# Altium schematic sheet Digital Output (DOUT).SchDoc
size A4; SheetNumber: 6; SheetTotal: 10
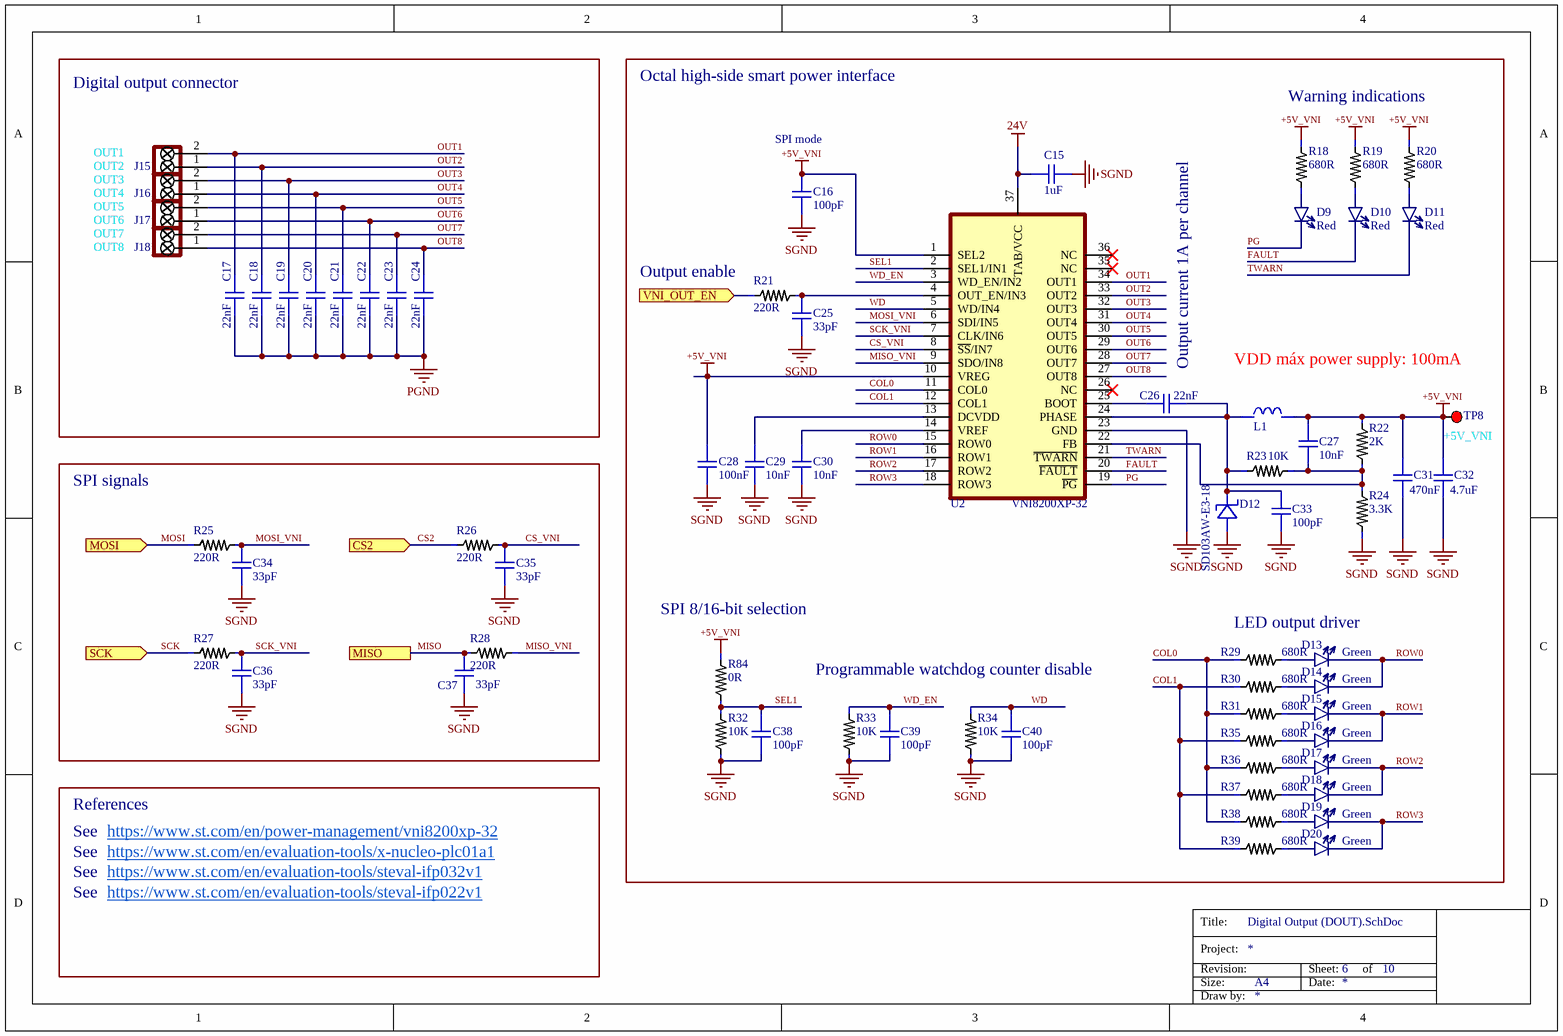
[diagram p0: Digital Output (DOUT).SchDoc]

## Parts
C15  value 1uF  [CAPC1005N]  (hidden comment: Multilayer Ceramic Capacitors)
C16  value 100pF  [CAPC1005N]  (hidden comment: Multilayer Ceramic Capacitors)
C17  value 22nF  [CAPC2012N]  (hidden comment: Multilayer Ceramic Capacitors)
C18  value 22nF  [CAPC2012N]  (hidden comment: Multilayer Ceramic Capacitors)
C19  value 22nF  [CAPC2012N]  (hidden comment: Multilayer Ceramic Capacitors)
C20  value 22nF  [CAPC2012N]  (hidden comment: Multilayer Ceramic Capacitors)
C21  value 22nF  [CAPC2012N]  (hidden comment: Multilayer Ceramic Capacitors)
C22  value 22nF  [CAPC2012N]  (hidden comment: Multilayer Ceramic Capacitors)
C23  value 22nF  [CAPC2012N]  (hidden comment: Multilayer Ceramic Capacitors)
C24  value 22nF  [CAPC2012N]  (hidden comment: Multilayer Ceramic Capacitors)
C25  value 33pF  [CAPC1005N]  (hidden comment: Multilayer Ceramic Capacitors)
C26  value 22nF  [CAPC1005N]  (hidden comment: Multilayer Ceramic Capacitors)
C27  value 10nF  [CAPC1005N]  (hidden comment: Multilayer Ceramic Capacitors)
C28  value 100nF  [CAPC1005N]  (hidden comment: Multilayer Ceramic Capacitors)
C29  value 10nF  [CAPC1005N]  (hidden comment: Multilayer Ceramic Capacitors)
C30  value 10nF  [CAPC1005N]  (hidden comment: Multilayer Ceramic Capacitors)
C31  value 470nF  [CAPC1005N]  (hidden comment: Multilayer Ceramic Capacitors)
C32  value 4.7uF  [CAPC1005N]  (hidden comment: Multilayer Ceramic Capacitors)
C33  value 100pF  [CAPC1005N]  (hidden comment: Multilayer Ceramic Capacitors)
C34  value 33pF  [CAPC1005N]  (hidden comment: Multilayer Ceramic Capacitors)
C35  value 33pF  [CAPC1005N]  (hidden comment: Multilayer Ceramic Capacitors)
C36  value 33pF  [CAPC1005N]  (hidden comment: Multilayer Ceramic Capacitors)
C37  value 33pF  [CAPC1005N]  (hidden comment: Multilayer Ceramic Capacitors)
C38  value 100pF  [CAPC1005N]  (hidden comment: Multilayer Ceramic Capacitors)
C39  value 100pF  [CAPC1005N]  (hidden comment: Multilayer Ceramic Capacitors)
C40  value 100pF  [CAPC1005N]  (hidden comment: Multilayer Ceramic Capacitors)
D9  value Red  [LEDC1608X80N_RED]  (hidden comment: Single Color LED)
D10  value Red  [LEDC1608X80N_RED]  (hidden comment: Single Color LED)
D11  value Red  [LEDC1608X80N_RED]  (hidden comment: Single Color LED)
D12  Part Number: SD103AW-E3-18  [SOD3705X110-2N]  (hidden comment: Schottky Diodes)
D13  value Green  [LEDC1608X80N_GREEN]  (hidden comment: Single Color LED)
D14  value Green  [LEDC1608X80N_GREEN]  (hidden comment: Single Color LED)
D15  value Green  [LEDC1608X80N_GREEN]  (hidden comment: Single Color LED)
D16  value Green  [LEDC1608X80N_GREEN]  (hidden comment: Single Color LED)
D17  value Green  [LEDC1608X80N_GREEN]  (hidden comment: Single Color LED)
D18  value Green  [LEDC1608X80N_GREEN]  (hidden comment: Single Color LED)
D19  value Green  [LEDC1608X80N_GREEN]  (hidden comment: Single Color LED)
D20  value Green  [LEDC1608X80N_GREEN]  (hidden comment: Single Color LED)
J15  Terminal Blocks  [CONB_FIX508P-2N]  (value not drawn)
J16  Terminal Blocks  [CONB_FIX508P-2N]  (value not drawn)
J17  Terminal Blocks  [CONB_FIX508P-2N]  (value not drawn)
J18  Terminal Blocks  [CONB_FIX508P-2N]  (value not drawn)
L1  Power Inductor  [INDP4018220N]  (value not drawn)
R18  value 680R  [RESC1005N]  (hidden comment: Thick Film Resistors)
R19  value 680R  [RESC1005N]  (hidden comment: Thick Film Resistors)
R20  value 680R  [RESC1005N]  (hidden comment: Thick Film Resistors)
R21  value 220R  [RESC1005N]  (hidden comment: Thick Film Resistors)
R22  value 2K  [RESC1608N]  (hidden comment: Thick Film Resistors)
R23  value 10K  [RESC1608N]  (hidden comment: Thick Film Resistors)
R24  value 3.3K  [RESC1608N]  (hidden comment: Thick Film Resistors)
R25  value 220R  [RESC1005N]  (hidden comment: Thick Film Resistors)
R26  value 220R  [RESC1005N]  (hidden comment: Thick Film Resistors)
R27  value 220R  [RESC1005N]  (hidden comment: Thick Film Resistors)
R28  value 220R  [RESC1005N]  (hidden comment: Thick Film Resistors)
R29  value 680R  [RESC1005N]  (hidden comment: Thick Film Resistors)
R30  value 680R  [RESC1005N]  (hidden comment: Thick Film Resistors)
R31  value 680R  [RESC1005N]  (hidden comment: Thick Film Resistors)
R32  value 10K  [RESC1005N]  (hidden comment: Thick Film Resistors)
R33  value 10K  [RESC1005N]  (hidden comment: Thick Film Resistors)
R34  value 10K  [RESC1005N]  (hidden comment: Thick Film Resistors)
R35  value 680R  [RESC1005N]  (hidden comment: Thick Film Resistors)
R36  value 680R  [RESC1005N]  (hidden comment: Thick Film Resistors)
R37  value 680R  [RESC1005N]  (hidden comment: Thick Film Resistors)
R38  value 680R  [RESC1005N]  (hidden comment: Thick Film Resistors)
R39  value 680R  [RESC1005N]  (hidden comment: Thick Film Resistors)
R84  value 0R  [RESC1005N]  (hidden comment: Thick Film Resistors)
TP8  Test point  [TP-1MM]  (value not drawn)  (no BOM)
U2  Part Number: VNI8200XP-32  [SOP50P1030X245-37N]  (hidden comment: Power Switch ICs)

## Blocks framed on the sheet
Digital output connector: C17-C24 J15-J18
SPI signals: C34-C37 R25-R28

## Ports
CS2 (in, see Main[3C], Microcontroller (MCU)[4C]), MISO (see Main[3C], Digital Input (DIN)[1C], Microcontroller (MCU)[4C]), MOSI (in, see Main[3C], Digital Input (DIN)[1C], Microcontroller (MCU)[4C]), SCK (in, see Main[3C], Digital Input (DIN)[1C], Microcontroller (MCU)[4C]), VNI_OUT_EN (in, see Main[3C], Microcontroller (MCU)[4C])

## Nets
24V: C15.1 U2.37(TAB/VCC)
+5V_VNI: C16.1 C27.1 C28.1 C31.1 C32.1 L1.2 R18.2 R19.2 R20.2 R22.2 R84.2 TP8.1 U2.1(SEL2) U2.10(VREG)
PGND: C17.2 C18.2 C19.2 C20.2 C21.2 C22.2 C23.2 C24.2
SGND: C15.2 C16.2 C25.2 C28.2 C29.2 C30.2 C31.2 C32.2 C33.2 C34.2 C35.2 C36.2 C37.2 C38.2 C39.2 C40.2 D12.A R24.1 R32.1 R33.1 R34.1 U2.23(GND)
COL0: R29.2 R31.2 R36.2 R38.2 U2.11(COL0)
COL1: R30.2 R35.2 R37.2 R39.2 U2.12(COL1)
CS2: R26.1 ; port CS2
CS_VNI: C35.1 R26.2 U2.8(~{SS}/IN7)
FAULT: D10.C U2.20(~{FAULT})
MISO: C37.1 R28.1 ; port MISO
MISO_VNI: R28.2 U2.9(SDO/IN8)
MOSI: R25.1 ; port MOSI
MOSI_VNI: C34.1 R25.2 U2.6(SDI/IN5)
OUT1: C17.1 J15.2 U2.34(OUT1)
OUT2: C18.1 J15.1 U2.33(OUT2)
OUT3: C19.1 J16.2 U2.32(OUT3)
OUT4: C20.1 J16.1 U2.31(OUT4)
OUT5: C21.1 J17.2 U2.30(OUT5)
OUT6: C22.1 J17.1 U2.29(OUT6)
OUT7: C23.1 J18.2 U2.28(OUT7)
OUT8: C24.1 J18.1 U2.27(OUT8)
PG: D9.C U2.19(~{PG})
ROW0: D13.C D14.C U2.15(ROW0)
ROW1: D15.C D16.C U2.16(ROW1)
ROW2: D17.C D18.C U2.17(ROW2)
ROW3: D19.C D20.C U2.18(ROW3)
SCK: R27.1 ; port SCK
SCK_VNI: C36.1 R27.2 U2.7(CLK/IN6)
SEL1: C38.1 R32.2 R84.1 U2.2(SEL1/IN1)
TWARN: D11.C U2.21(~{TWARN})
VNI_OUT_EN: R21.1 ; port VNI_OUT_EN
WD: C40.1 R34.2 U2.5(WD/IN4)
WD_EN: C39.1 R33.2 U2.3(WD_EN/IN2)
NetC25_1: C25.1 R21.2 U2.4(OUT_EN/IN3)
NetC26_1: C26.1 U2.25(BOOT)
NetC26_2: C26.2 C33.1 D12.C L1.1 R23.1 U2.24(PHASE)
NetC27_2: C27.2 R22.1 R23.2 R24.2 U2.22(FB)
NetC29_1: C29.1 U2.13(DCVDD)
NetC30_1: C30.1 U2.14(VREF)
NetD9_A: D9.A R18.1
NetD10_A: D10.A R19.1
NetD11_A: D11.A R20.1
NetD13_A: D13.A R29.1
NetD14_A: D14.A R30.1
NetD15_A: D15.A R31.1
NetD16_A: D16.A R35.1
NetD17_A: D17.A R36.1
NetD18_A: D18.A R37.1
NetD19_A: D19.A R38.1
NetD20_A: D20.A R39.1

Not connected (* = marked no-connect by the designer): U2 26(NC)* 35(NC)* 36(NC)*

## Notes on the sheet
- Octal high-side smart power interface
- Warning indications
- OUT1
- OUT2
- (near C16) SPI mode
- OUT3
- OUT4
- OUT5
- OUT6
- OUT7
- OUT8
- (near R21) Output enable
- (near C26) Output current 1A per channel
- VDD máx power supply: 100mA
- (near TP8) +5V_VNI
- (near R84) SPI 8/16-bit selection
- LED output driver
- Programmable watchdog counter disable
- References
- See
- https://www.st.com/en/power-management/vni8200xp-32
- https://www.st.com/en/evaluation-tools/x-nucleo-plc01a1
- https://www.st.com/en/evaluation-tools/steval-ifp032v1
- https://www.st.com/en/evaluation-tools/steval-ifp022v1
- Title:
- Project:
- Revision:
- Size:
- A4
- Sheet:
- Date:
- of
- Draw by:

## Library data of the parts
C15 = C-MLCC-1uF-50V-10%-0402: Multilayer Ceramic Capacitors MLCC - SMD/SMT 50V 1uF X5R 0402 10% HI CV; Part Number: CC0402KRX5R9BB105; Manufacturer: YAGEO; Mounting Type: SMT; Mouser Part #: 603-CC0402KX5R9BB105; Digikey Part #: 13-CC0402KRX5R9BB105CT-ND; JLCPCB Part #: C7500380
C16 C33 C38-C40 = C-MLCC-100pF-50V-10%-0402: Multilayer Ceramic Capacitors MLCC - SMD/SMT 50 V 100pF X7R 0402 10%; Part Number: CC0402KRX7R9BB101; Manufacturer: YAGEO; Mounting Type: SMT; Mouser Part #: 603-CC402KRX7R9BB101; Digikey Part #: 311-1419-1-ND; JLCPCB Part #: C281751
C17-C24 = C-MLCC-22nF-100V-10%-0805: Multilayer Ceramic Capacitors MLCC - SMD/SMT 100 V 0.022 uF X7R 0805 10%; Part Number: CC0805KRX7R0BB223; Manufacturer: YAGEO; Mounting Type: SMT; Mouser Part #: 603-CC805KRX7R0BB223; Digikey Part #: 311-1473-1-ND; JLCPCB Part #: C107137
C25 C34-C37 = C-MLCC-33pF-50V-10%-0402: Multilayer Ceramic Capacitors MLCC - SMD/SMT 50 V 33 pF C0G 0402 1%; Part Number: CC0402KRNPO9BN330; Manufacturer: YAGEO; Mounting Type: SMT; Mouser Part #: 603-CC0402KRNP9BN330; Digikey Part #: 13-CC0402KRNPO9BN330CT-ND; JLCPCB Part #: C107005
C26 = C-MLCC-22nF-50V-10%-0402: Multilayer Ceramic Capacitors MLCC - SMD/SMT 50 V 0.022uF X7R 0402 10%; Part Number: CC0402KRX7R9BB223; Manufacturer: YAGEO; Mounting Type: SMT; Mouser Part #: 603-CC402KRX7R9BB223; Digikey Part #: 311-1722-1-ND; JLCPCB Part #: C107026
C27 C29 C30 = C-MLCC-10nF-50V-10%-0402: Multilayer Ceramic Capacitors MLCC - SMD/SMT 50 V 0.01uF X7R 0402 10%; Part Number: CC0402KRX7R9BB103; Manufacturer: YAGEO; Mounting Type: SMT; Mouser Part #: 603-CC402KRX7R9BB103; Digikey Part #: 311-1349-1-ND; JLCPCB Part #: C60133
C28 = C-MLCC-100nF-50V-10%-0402: Multilayer Ceramic Capacitors MLCC - SMD/SMT 50 V 0.1uF X7R 0402 10%; Part Number: CC0402KRX5R9BB104; Manufacturer: YAGEO; Mounting Type: SMT; Mouser Part #: 603-CC402KRX5R9BB104; Digikey Part #: 311-3342-1-ND; JLCPCB Part #: C105882
C31 = C-MLCC-470nF-50V-10%-0402: Multilayer Ceramic Capacitors MLCC - SMD/SMT 50 V 0.470uF X7R 0402 10%; Part Number: CC0402KRX5R9BB474; Manufacturer: YAGEO; Mounting Type: SMT; Mouser Part #: 603-CC0402KRX59BB474; Digikey Part #: 13-CC0402KRX5R9BB474CT-ND; JLCPCB Part #: C513552
C32 = C-MLCC-4.7uF-10V-10%-0402: Multilayer Ceramic Capacitors MLCC - SMD/SMT 10V 4.7uF X5R 0402 10% HI CV; Part Number: CC0402KRX5R6BB475; Manufacturer: YAGEO; Mounting Type: SMT; Mouser Part #: 603-CC0402KR5R6BB475; Digikey Part #: 13-CC0402KRX5R6BB475CT-ND; JLCPCB Part #: C326586
D9-D11 = D-LED-RED-2V-20mA-0603: Standard Single Color LEDs 0603 Red; Part Number: LTST-C190KRKT; Manufacturer: LITEON; Mounting Type: SMT; Mouser Part #: 859-LTST-C190KRKT; Digikey Part #: 160-1436-1-ND; JLCPCB Part #: C94869
D12 = D-SCH-350mA-40V-SOD123: Schottky Diodes & Rectifiers 350mA 40V SOD123; Manufacturer: Vishay Semiconductors; Mounting Type: SMT; Mouser Part #: 78-SD103AW-E3-18; Digikey Part #: SD103AW-E3-18CT-ND; JLCPCB Part #: C181204
D13-D20 = D-LED-GREEN-2V-20mA-0603: Standard Single Color LEDs 0603 Green; Part Number: LTST-C190KGKT; Manufacturer: LITEON; Mounting Type: SMT; Mouser Part #: 859-LTST-C190KGKT; Digikey Part #: 160-1435-1-ND; JLCPCB Part #: C125094
J15-J18 = J-02-5P08-TERM-F-VERT-TH: Pluggable Terminal Blocks 2 Pos 5.08mm pitch Through Hole Header; Manufacturer: Adam Tech; Part Number: EBA-02-D-BU-01; Mouser Part #: 737-EBA-02-D-BU-01; Mounting Type: THT; Digikey Part #: ED2609-ND; JLCPCB Part #: C8475
L1 = L-PWR-100uH-0.42A-SMT: Power Inductors - SMD 100uH 0.42A 1.6Ohms; Manufacturer: Bourns; Part Number: SRN4018-101M; Value: 100uH; Mounting Type: SMT; Mouser Part #: 652-SRN4018-101M; Digikey Part #: SRN4018-101MCT-ND; JLCPCB Part #: C83471
R18-R20 R29-R31 R35-R39 = R-THICK-680R-62.5mW-1%-0402: Thick Film Resistors - SMD General Purpose Chip Resistor 0402, 680Ohms, 1%, 1/16W; Part Number: RC0402FR-07680RL; Manufacturer: YAGEO; Mounting Type: SMT; Mouser Part #: 603-RC0402FR-07680RL; Digikey Part #: 311-680LRCT-ND; JLCPCB Part #: C137948
R21 R25-R28 = R-THICK-220R-62.5mW-1%-0402: Thick Film Resistors - SMD General Purpose Chip Resistor 0402, 220Ohms, 1%, 1/16W; Part Number: RC0402FR-07220RL; Manufacturer: YAGEO; Mounting Type: SMT; Mouser Part #: 603-RC0402FR-07220RL; Digikey Part #: 311-220LRCT-ND; JLCPCB Part #: C112291
R22 = R-THICK-2K-100mW-1%-0603: Thick Film Resistors - SMD General Purpose Chip Resistor 0603, 2kOhms, 1%, 1/10W; Part Number: RC0603FR-072KL; Manufacturer: YAGEO; Mounting Type: SMT; Mouser Part #: 603-RC0603FR-072KL; Digikey Part #: 311-2.00KHRCT-ND; JLCPCB Part #: C105576
R23 = R-THICK-10K-100mW-1%-0603: Thick Film Resistors - SMD General Purpose Chip Resistor 0603, 10kOhms, 1%, 1/10W; Part Number: RC0603FR-0710KL; Manufacturer: YAGEO; Mounting Type: SMT; Mouser Part #: 603-RC0603FR-0710KL; Digikey Part #: 311-10.0KHRCT-ND; JLCPCB Part #: C98220
R24 = R-THICK-3K3-100mW-1%-0603: Thick Film Resistors - SMD General Purpose Chip Resistor 0603, 3.3kOhms, 1%, 1/10W; Part Number: RC0603FR-073K3L; Manufacturer: YAGEO; Mounting Type: SMT; Mouser Part #: 603-RC0603FR-073K3L; Digikey Part #: 311-3.30KHRCT-ND; JLCPCB Part #: C108078
R32-R34 = R-THICK-10K-62.5mW-1%-0402: Thick Film Resistors - SMD General Purpose Chip Resistor 0402, 10kOhms, 1%, 1/16W; Part Number: RC0402FR-0710KL; Manufacturer: YAGEO; Mounting Type: SMT; Mouser Part #: 603-RC0402FR-0710KL; Digikey Part #: 311-10.0KLRCT-ND; JLCPCB Part #: C60490
R84 = R-THICK-0R-62.5mW-1%-0402: Thick Film Resistors - SMD General Purpose Chip Resistor 0402, 0Ohms, 1%, 1/16W; Part Number: RC0402FR-070RL; Manufacturer: YAGEO; Mounting Type: SMT; Mouser Part #: 603-RC0402FR-070RL; Digikey Part #: 311-0.0LRCT-ND; JLCPCB Part #: C106231
TP8 = TP-1MM-SMD: Test point, 1mm, exposed pad; Mounting Type: SMD; JLCPCB Part #: C5199810
U2 = U-VNI8200XP-32: Power Switch ICs - Power Distribution 8-Ch Octal HS SSR 100mA VIPower; Manufacturer: STMicroelectronics; Mounting Type: SMT; Mouser Part #: 511-VNI8200XP-32; Digikey Part #: 497-VNI8200XP-32-ND; JLCPCB Part #: C1556834